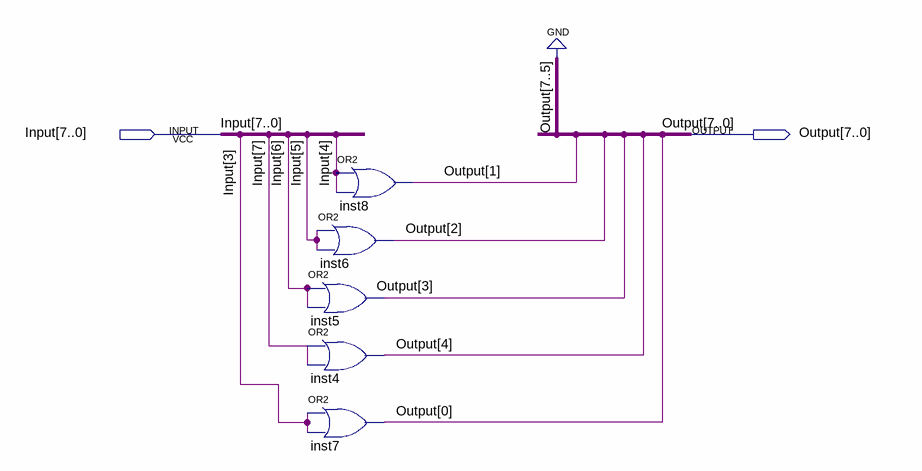
[diagram p0: schematic sheet]
// Quartus schematic SHIFT_3.bdf as structural Verilog: 5 symbols, 2 pins
module SHIFT_3 (
  input  [7:0] Input,
  output [7:0] Output
);

  or inst5 (Output[3], Input[6], Input[6]);
  or inst4 (Output[4], Input[7], Input[7]);
  or inst7 (Output[0], Input[3], Input[3]);
  or inst8 (Output[1], Input[4], Input[4]);
  or inst6 (Output[2], Input[5], Input[5]);

  assign Output[7:5] = 3'b000;
endmodule
